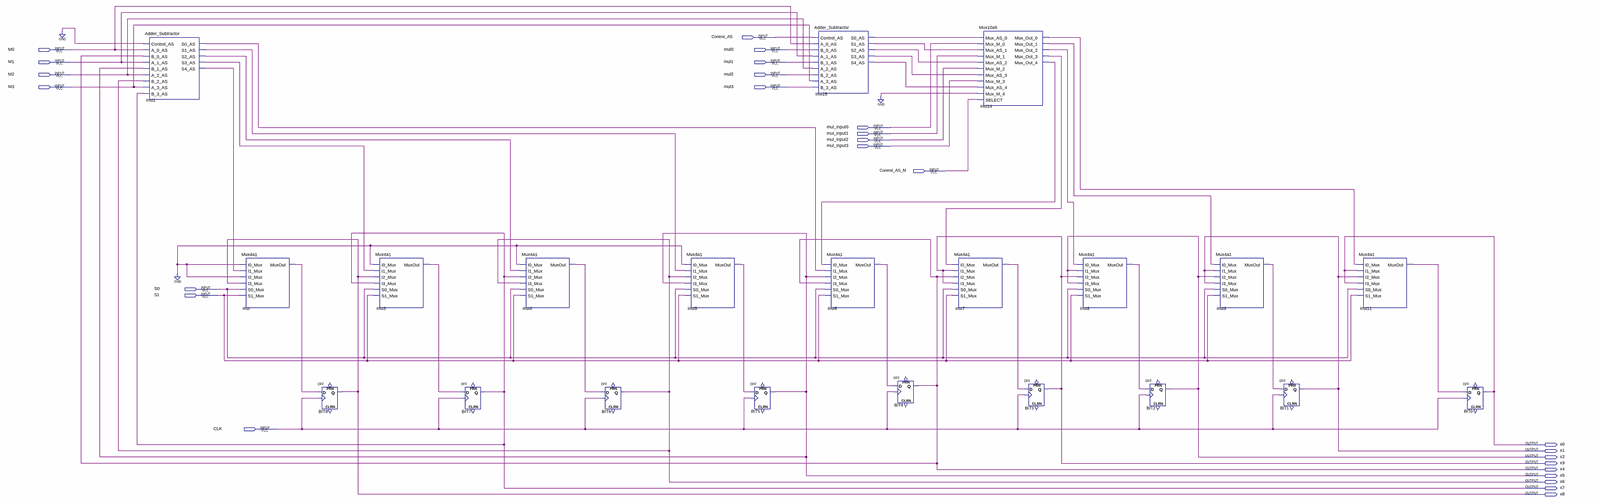
[diagram p0: schematic sheet, whole]
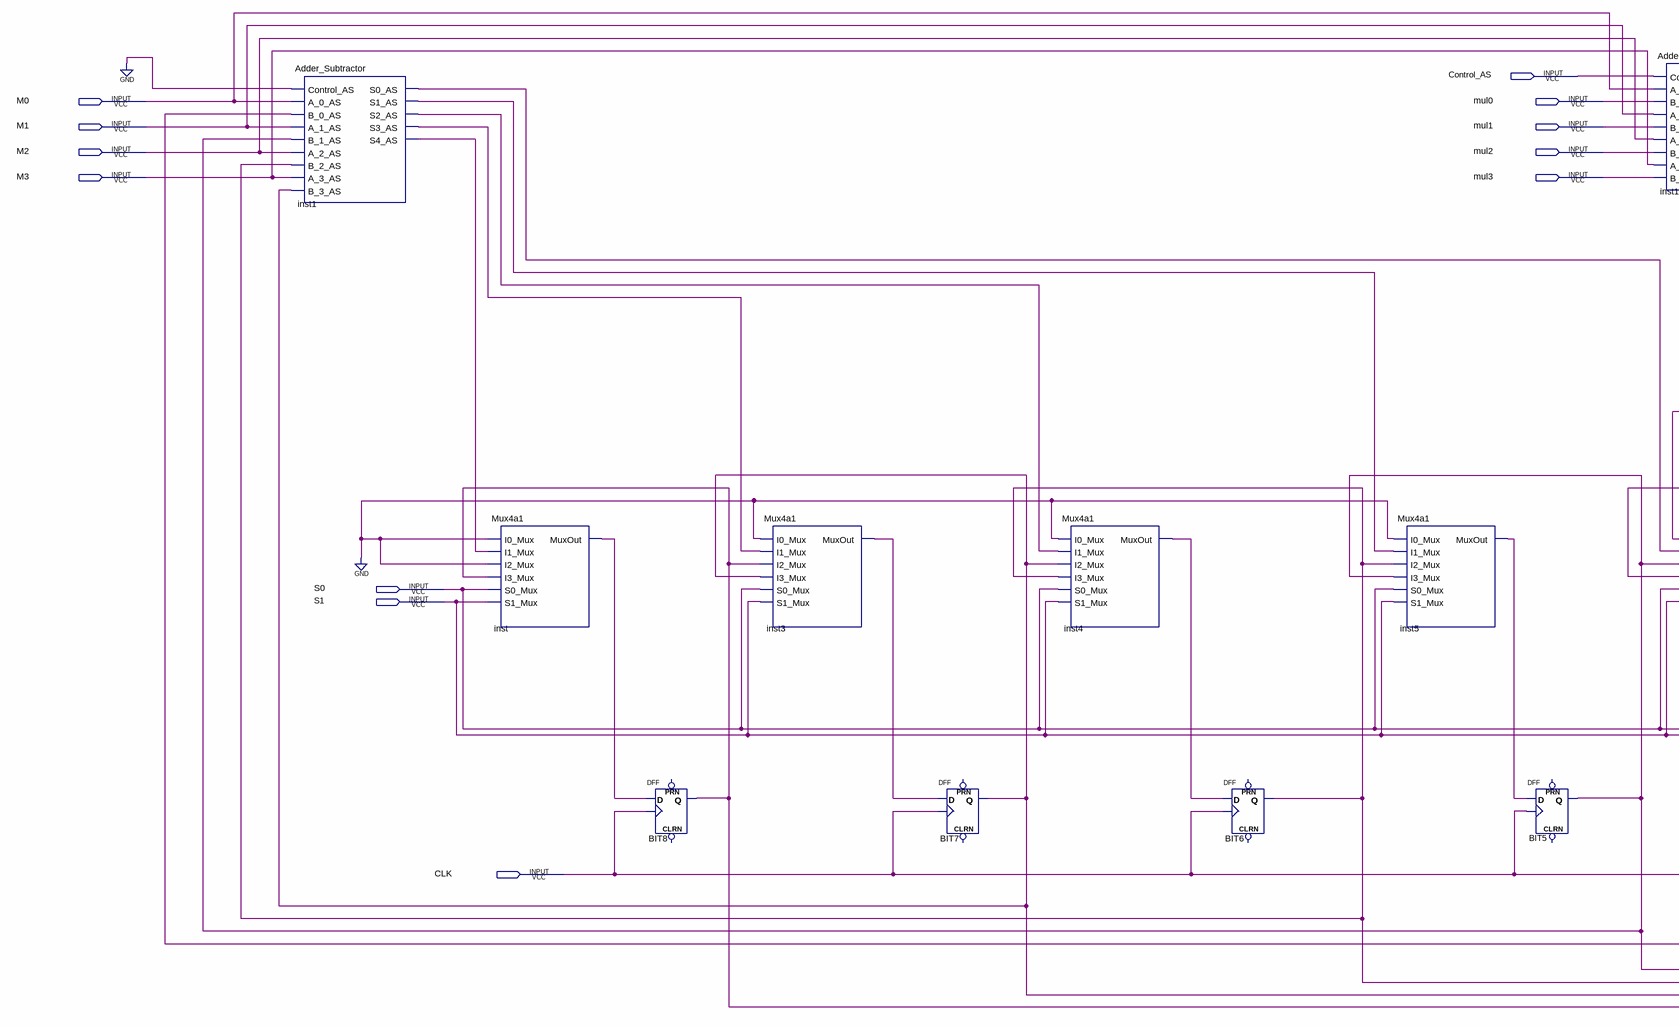
[diagram p1: schematic sheet, left part]
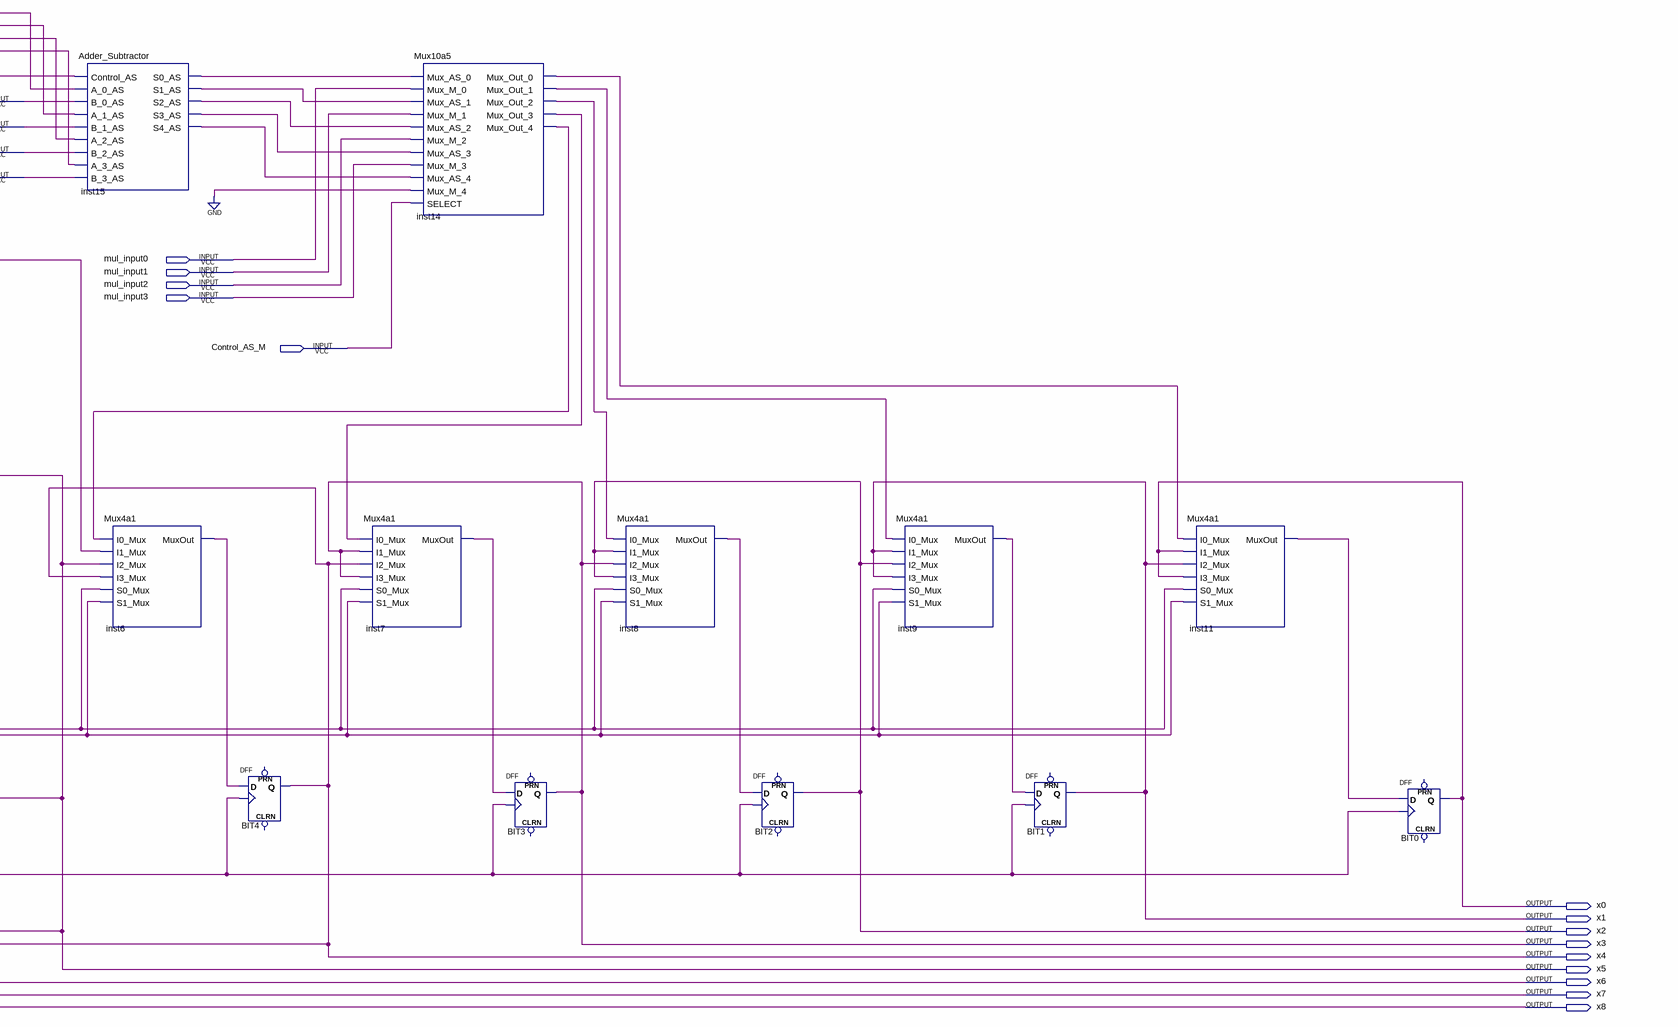
[diagram p2: schematic sheet, right part]
// Quartus schematic registro.bdf as structural Verilog: 21 symbols, 26 pins
module registro (
  input  Control_AS,
  input  M0,
  input  mul0,
  input  M1,
  input  mul1,
  input  M2,
  input  mul2,
  input  M3,
  input  mul3,
  input  mul_input0,
  input  mul_input1,
  input  mul_input2,
  input  mul_input3,
  input  Control_AS_M,
  input  S0,
  input  S1,
  input  CLK,
  output x0,
  output x1,
  output x2,
  output x3,
  output x4,
  output x5,
  output x6,
  output x7,
  output x8
);

  wire inst1_s0_as, inst1_s1_as, inst1_s2_as, inst1_s3_as, inst1_s4_as, inst3_muxout, inst4_muxout,
       inst5_muxout, inst6_muxout, inst7_muxout, inst8_muxout, inst9_muxout, inst11_muxout, inst14_mux_out_0,
       inst14_mux_out_1, inst14_mux_out_2, inst14_mux_out_3, inst14_mux_out_4, inst15_s0_as, inst15_s1_as,
       inst15_s2_as, inst15_s3_as, inst15_s4_as, inst_muxout;

  Adder_Subtractor inst1 (
    .Control_AS(1'b0), .A_0_AS(M0), .B_0_AS(x4), .A_1_AS(M1), .B_1_AS(x5), .A_2_AS(M2), .B_2_AS(x6),
    .A_3_AS(M3), .B_3_AS(x7), .S0_AS(inst1_s0_as), .S1_AS(inst1_s1_as), .S2_AS(inst1_s2_as),
    .S3_AS(inst1_s3_as), .S4_AS(inst1_s4_as));
  Mux4a1 inst (
    .I0_Mux(1'b0), .I1_Mux(inst1_s4_as), .I2_Mux(1'b0), .I3_Mux(x8), .S0_Mux(S0), .S1_Mux(S1),
    .MuxOut(inst_muxout));
  DFF BIT8 (.CLK(CLK), .D(inst_muxout), .Q(x8));  // open: CLRN, PRN
  Mux4a1 inst3 (
    .I0_Mux(1'b0), .I1_Mux(inst1_s3_as), .I2_Mux(x8), .I3_Mux(x7), .S0_Mux(S0), .S1_Mux(S1),
    .MuxOut(inst3_muxout));
  DFF BIT7 (.CLK(CLK), .D(inst3_muxout), .Q(x7));  // open: CLRN, PRN
  Mux4a1 inst4 (
    .I0_Mux(1'b0), .I1_Mux(inst1_s2_as), .I2_Mux(x7), .I3_Mux(x6), .S0_Mux(S0), .S1_Mux(S1),
    .MuxOut(inst4_muxout));
  DFF BIT6 (.CLK(CLK), .D(inst4_muxout), .Q(x6));  // open: CLRN, PRN
  Mux4a1 inst5 (
    .I0_Mux(1'b0), .I1_Mux(inst1_s1_as), .I2_Mux(x6), .I3_Mux(x5), .S0_Mux(S0), .S1_Mux(S1),
    .MuxOut(inst5_muxout));
  DFF BIT5 (.CLK(CLK), .D(inst5_muxout), .Q(x5));  // open: CLRN, PRN
  Adder_Subtractor inst15 (
    .Control_AS(Control_AS), .A_0_AS(M0), .B_0_AS(mul0), .A_1_AS(M1), .B_1_AS(mul1), .A_2_AS(M2),
    .B_2_AS(mul2), .A_3_AS(M3), .B_3_AS(mul3), .S0_AS(inst15_s0_as), .S1_AS(inst15_s1_as),
    .S2_AS(inst15_s2_as), .S3_AS(inst15_s3_as), .S4_AS(inst15_s4_as));
  Mux4a1 inst6 (
    .I0_Mux(inst14_mux_out_4), .I1_Mux(inst1_s0_as), .I2_Mux(x5), .I3_Mux(x4), .S0_Mux(S0), .S1_Mux(S1),
    .MuxOut(inst6_muxout));
  DFF BIT4 (.CLK(CLK), .D(inst6_muxout), .Q(x4));  // open: CLRN, PRN
  Mux4a1 inst7 (
    .I0_Mux(inst14_mux_out_3), .I1_Mux(x3), .I2_Mux(x4), .I3_Mux(x3), .S0_Mux(S0), .S1_Mux(S1),
    .MuxOut(inst7_muxout));
  Mux10a5 inst14 (
    .Mux_AS_0(inst15_s0_as), .Mux_M_0(mul_input0), .Mux_AS_1(inst15_s1_as), .Mux_M_1(mul_input1),
    .Mux_AS_2(inst15_s2_as), .Mux_M_2(mul_input2), .Mux_AS_3(inst15_s3_as), .Mux_M_3(mul_input3),
    .Mux_AS_4(inst15_s4_as), .Mux_M_4(1'b0), .SELECT(Control_AS_M), .Mux_Out_0(inst14_mux_out_0),
    .Mux_Out_1(inst14_mux_out_1), .Mux_Out_2(inst14_mux_out_2), .Mux_Out_3(inst14_mux_out_3),
    .Mux_Out_4(inst14_mux_out_4));
  DFF BIT3 (.CLK(CLK), .D(inst7_muxout), .Q(x3));  // open: CLRN, PRN
  Mux4a1 inst8 (
    .I0_Mux(inst14_mux_out_2), .I1_Mux(x2), .I2_Mux(x3), .I3_Mux(x2), .S0_Mux(S0), .S1_Mux(S1),
    .MuxOut(inst8_muxout));
  DFF BIT2 (.CLK(CLK), .D(inst8_muxout), .Q(x2));  // open: CLRN, PRN
  Mux4a1 inst9 (
    .I0_Mux(inst14_mux_out_1), .I1_Mux(x1), .I2_Mux(x2), .I3_Mux(x1), .S0_Mux(S0), .S1_Mux(S1),
    .MuxOut(inst9_muxout));
  DFF BIT1 (.CLK(CLK), .D(inst9_muxout), .Q(x1));  // open: CLRN, PRN
  Mux4a1 inst11 (
    .I0_Mux(inst14_mux_out_0), .I1_Mux(x0), .I2_Mux(x1), .I3_Mux(x0), .S0_Mux(S0), .S1_Mux(S1),
    .MuxOut(inst11_muxout));
  DFF BIT0 (.CLK(CLK), .D(inst11_muxout), .Q(x0));  // open: CLRN, PRN
endmodule
